# EAGLE schematic mute_circuit (EAGLE 9.6.2)
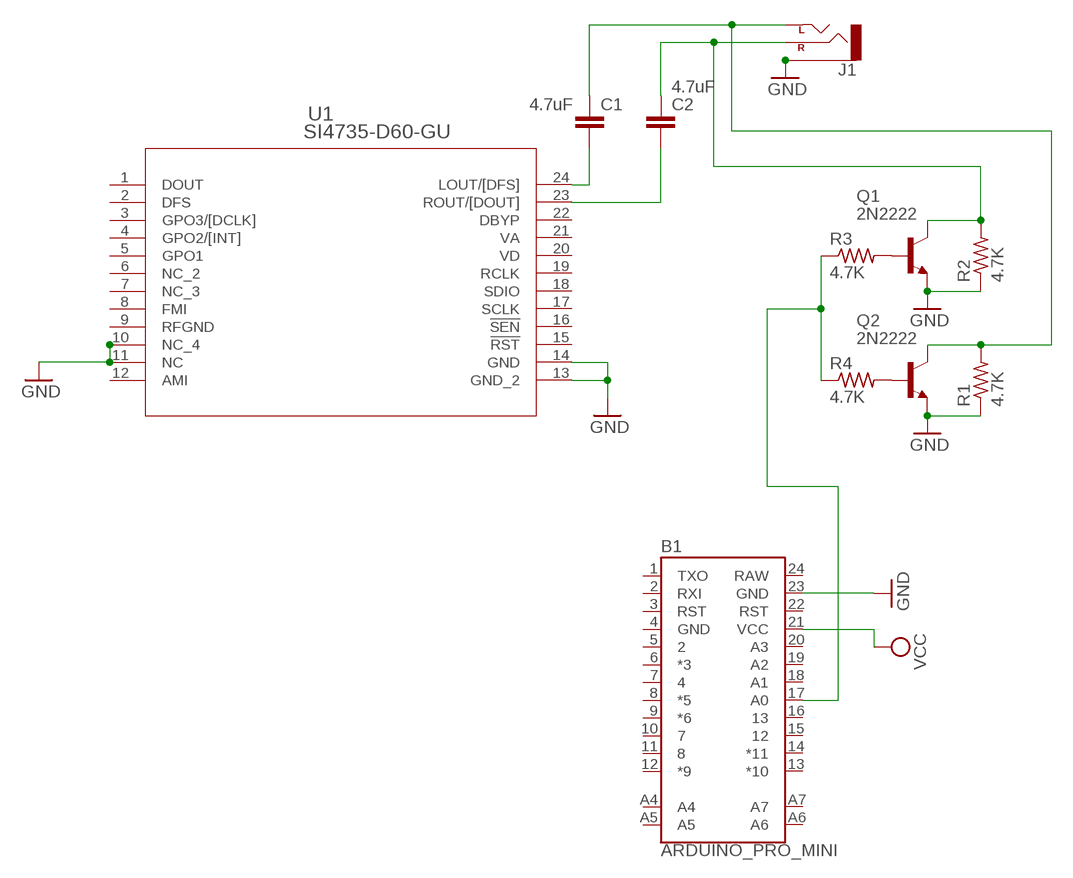
[diagram p0: schematic, sheet 1]

## Parts
B1  ARDUINO_PRO_MINI  [ARDUINO_PRO_MINI]
C1  4.7uF  CXXC10B6  [XC10B6]
C2  4.7uF  CXXC10B6  [XC10B6]
J1  AUDIO_JACK_2.5MMSPECIAL_POGO_PINS  [STEREOJACK2.5MM_SPECIAL_POGOPINS]
Q1  2N2222  [TO18]
Q2  2N2222  [TO18]
R1  4.7K  R-US_0207/5V  [0207/5V]
R2  4.7K  R-US_0207/5V  [0207/5V]
R3  4.7K  R-US_0207/5V  [0207/5V]
R4  4.7K  R-US_0207/5V  [0207/5V]
U1  SI4735-D60-GU  [SSOP24_SIL]

## Nets
GND: B1.23(GND) J1.RING1(SLEEVE) Q1.1(E) Q2.1(E) R1.1 R2.1 U1.10(NC_4) U1.11(NC) U1.13(GND_2) U1.14(GND)
N$1: C1.2 U1.24(LOUT/[DFS])
N$2: C2.2 U1.23(ROUT/[DOUT])
N$5: C2.1 J1.TIP(RIGHT) Q1.3(C) R2.2
N$6: C1.1 J1.SHIELD(LEFT) Q2.3(C) R1.2
N$7: Q1.2(B) R3.2
N$8: Q2.2(B) R4.2
N$9: B1.17(A0) R3.1 R4.1
VCC: B1.21(VCC)
Unconnected: B1.1(TXO) B1.2(RXI) B1.3(RST) B1.5 B1.6(*3) B1.7 B1.8(*5) B1.9(*6) B1.10 B1.11 B1.12(*9) B1.13(*10) B1.14(*11) B1.15 B1.16 B1.18(A1) B1.19(A2) B1.20(A3) B1.22(RST) B1.A4 B1.A5 B1.A6 B1.A7 U1.1(DOUT) U1.2(DFS) U1.3(GPO3/[DCLK]) U1.4(GPO2/[INT]) U1.5(GPO1) U1.6(NC_2) U1.7(NC_3) U1.8(FMI) U1.9(RFGND) U1.12(AMI) U1.15(!RST) U1.16(!SEN) U1.17(SCLK) U1.18(SDIO) U1.19(RCLK) U1.22(DBYP)

## Power pins joined to a net without a drawn wire
GND: B1.4(GND)
RAW: B1.24(RAW)
VA: U1.21(VA)
VD: U1.20(VD)

## Library data of the parts
B1 = SparkFun-Boards:ARDUINO_PRO_MINI: SparkFun Pro Mini Pro Mini compatible footprint. Dimensions: 0.7 x 1.3" PCB Thickness: 0.8mm SparkFun Products: 3.3V/8MHz <https://www.sparkfun.com/products/11114> 5V/16MHz <https://www.sparkfun.com/products/11113>
C1 C2 = rcl:CX: X CAPACITOR for power line; SPICEPREFIX: C
J1 = SparkFun-Connectors:AUDIO_JACK_2.5MM: Audio Jack 2.5mm variants of PTH and SMT audio jacks. SparkFun Products: SparkFun PicoBoard <https://www.sparkfun.com/products/11888>- 2.5mm SMD
Q1 Q2 = transistor-npn:2N2222*: NPN Transistor
R1-R4 = resistor:R-US_: RESISTOR, American symbol
U1 = si4735:SI4735-D60-GU; BUILT_BY: EMA_Cory; COPYRIGHT: Copyright (C) 2018 Accelerated Designs. All rights reserved; DATASHEET: https://www.silabs.com/documents/public/data-sheets/Si4730-31-34-35-D60.pdf; MANUFACTURER_PART_NUMBER: SI4735-D60-GU; SOURCELIBRARY: Silicon_Labs_2020-04-23; VENDOR: Silicon Labs